# EAGLE design Breakout2v2 (EAGLE 9.0.1)
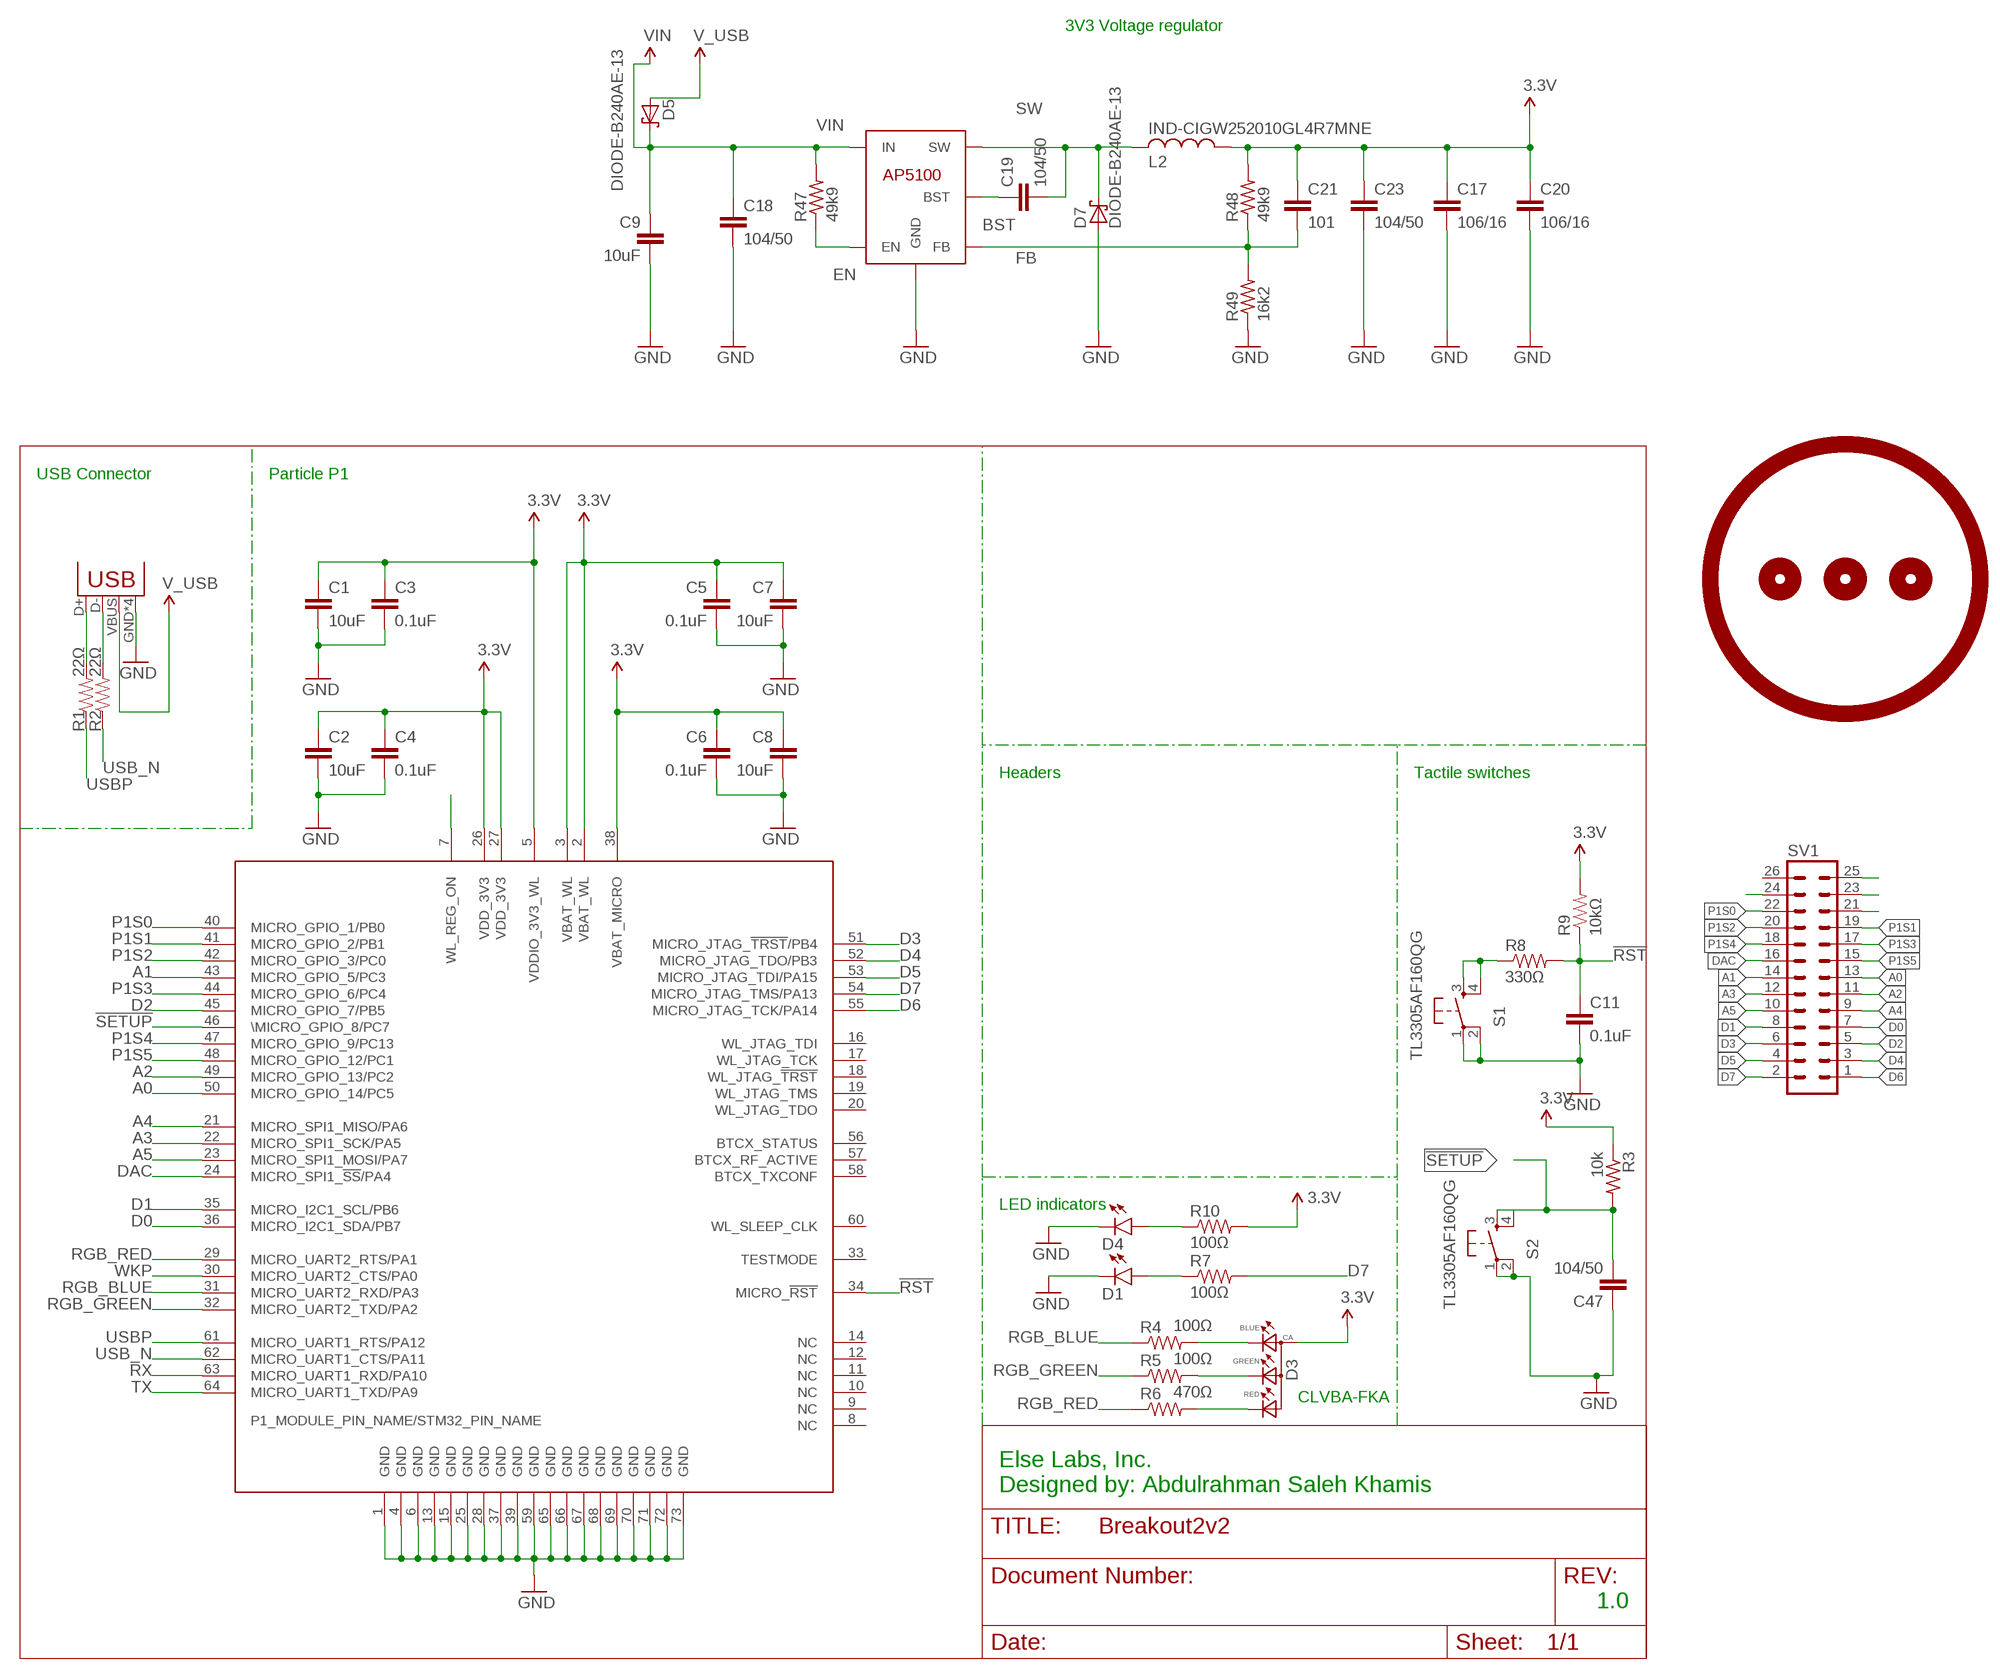
[diagram p0: schematic, sheet 1]

## Parts
C1  10uF  CAP0805  [0805]
C2  10uF  CAP0805  [0805]
C3  0.1uF  CAP0805  [0805]
C4  0.1uF  CAP0805  [0805]
C5  0.1uF  CAP0805  [0805]
C6  0.1uF  CAP0805  [0805]
C7  10uF  CAP0805  [0805]
C8  10uF  CAP0805  [0805]
C9  10uF  CAP0805  [0805]
C11  0.1uF  CAP0805  [0805]
C17  106/16  C-EUC0805  [C0805]
C18  104/50  C-EUC0603  [C0603]
C19  104/50  C-EUC0603  [C0603]
C20  106/16  C-EUC0805  [C0805]
C21  101  C-EUC0603  [C0603]
C23  104/50  C-EUC0603  [C0603]
C47  104/50  C-EUC0603  [C0603]
D1  LED0603  [LED-0603]
D3  CLVBA-FKAPLCC  [4-PLCC]
D4  LED0603  [LED-0603]
D5  DIODE-B240AE-13  [DO-214AC]
D7  DIODE-B240AE-13  [DO-214AC]
IC5  SMSP-BUCK-AP5100  [SOT23-6]
JP1  USBUSB-MICROB-SLOT-HOLE  [USB-MICROB-SLOT-HOLE]
L2  IND-CIGW252010GL4R7MNE  [L2520]
R1  22Ω  RESISTOR0805-RES  [0805]
R2  22Ω  RESISTOR0805-RES  [0805]
R3  10k  R-US_R0603  [R0603]
R4  100Ω  RESISTOR0805-RES  [0805]
R5  100Ω  RESISTOR0805-RES  [0805]
R6  470Ω  RESISTOR0805-RES  [0805]
R7  100Ω  RESISTOR0805-RES  [0805]
R8  330Ω  RESISTOR0805-RES  [0805]
R9  10kΩ  RESISTOR0805-RES  [0805]
R10  100Ω  RESISTOR0805-RES  [0805]
R47  49k9  R-US_R0603  [R0603]
R48  49k9  R-US_R0603  [R0603]
R49  16k2  R-US_R0603  [R0603]
S1  TL3305AF160QG  SWITCH-MOMENTARY-4.5MX4.5M  [TACTILE_SWITCH_SMD_4.5X4.5MM]
S2  TL3305AF160QG  SWITCH-MOMENTARY-4.5MX4.5M  [TACTILE_SWITCH_SMD_4.5X4.5MM]
SV1  MA13-2  [MA13-2]
U$1  LOGO  [LOGO]
UC1  P1  [WM-N-BM-14]

## Nets
3.3V: C1.1 C2.1 C3.1 C4.1 C5.1 C6.1 C7.1 C8.1 C17.1 C20.1 C21.1 C23.1 D3.2(ANODE) L2.P$1 R3.1 R9.2 R10.2 R48.2 UC1.2(VBAT_WL) UC1.3(VBAT_WL) UC1.5(VDDIO_3V3_WL) UC1.26(VDD_3V3) UC1.27(VDD_3V3) UC1.38(VBAT_MICRO)
!RST: C11.1 R8.2 R9.1 UC1.34(MICRO_!RST!)
!SETUP: C47.2 R3.2 S2.3 S2.4 UC1.46(\MICRO_GPIO_8/PC7)
A0: SV1.13 UC1.50(MICRO_GPIO_14/PC5)
A1: SV1.14 UC1.43(MICRO_GPIO_5/PC3)
A2: SV1.11 UC1.49(MICRO_GPIO_13/PC2)
A3: SV1.12 UC1.22(MICRO_SPI1_SCK/PA5)
A4: SV1.9 UC1.21(MICRO_SPI1_MISO/PA6)
A5: SV1.10 UC1.23(MICRO_SPI1_MOSI/PA7)
BLR: D3.3(BLUE) R4.2
BST: C19.1 IC5.1(BST)
D0: SV1.7 UC1.36(MICRO_I2C1_SDA/PB7)
D1: SV1.8 UC1.35(MICRO_I2C1_SCL/PB6)
D2: SV1.5 UC1.45(MICRO_GPIO_7/PB5)
D3: SV1.6 UC1.51(MICRO_JTAG_!TRST!/PB4)
D4: SV1.3 UC1.52(MICRO_JTAG_TDO/PB3)
D5: SV1.4 UC1.53(MICRO_JTAG_TDI/PA15)
D6: SV1.1 UC1.55(MICRO_JTAG_TCK/PA14)
D7: R7.2 SV1.2 UC1.54(MICRO_JTAG_TMS/PA13)
DAC: SV1.16 UC1.24(MICRO_SPI1_!SS!/PA4)
EN: IC5.4(EN) R47.1
FB: C21.2 IC5.3(FB) R48.1 R49.2
GND: C1.2 C2.2 C3.2 C4.2 C5.2 C6.2 C7.2 C8.2 C9.2 C11.2 C17.2 C18.2 C20.2 C23.2 C47.1 D1.C D4.C D7.A IC5.2(GND) JP1.GND JP1.P$1(GND) JP1.P$2(GND) JP1.P$3(GND) R49.1 S1.1 S1.2 S2.1 S2.2 UC1.1(GND) UC1.4(GND) UC1.6(GND) UC1.13(GND) UC1.15(GND) UC1.25(GND) UC1.28(GND) UC1.37(GND) UC1.39(GND) UC1.59(GND) UC1.65(GND) UC1.66(GND) UC1.67(GND) UC1.68(GND) UC1.69(GND) UC1.70(GND) UC1.71(GND) UC1.72(GND) UC1.73(GND)
GRR: D3.4(GREEN) R5.2
N$2: JP1.D+ R1.2
N$3: JP1.D- R2.2
N$6: D1.A R7.1
N$7: R8.1 S1.3 S1.4
N$9: D4.A R10.1
N$29: SV1.21
N$31: SV1.23
N$32: SV1.24
N$33: SV1.25
N$43: UC1.7(WL_REG_ON)
P1S0: SV1.22 UC1.40(MICRO_GPIO_1/PB0)
P1S1: SV1.19 UC1.41(MICRO_GPIO_2/PB1)
P1S2: SV1.20 UC1.42(MICRO_GPIO_3/PC0)
P1S3: SV1.17 UC1.44(MICRO_GPIO_6/PC4)
P1S4: SV1.18 UC1.47(MICRO_GPIO_9/PC13)
P1S5: SV1.15 UC1.48(MICRO_GPIO_12/PC1)
RER: D3.1(RED) R6.2
RGB_BLUE: R4.1 UC1.31(MICRO_UART2_RXD/PA3)
RGB_GREEN: R5.1 UC1.32(MICRO_UART2_TXD/PA2)
RGB_RED: R6.1 UC1.29(MICRO_UART2_RTS/PA1)
RX: UC1.63(MICRO_UART1_RXD/PA10)
SW: C19.2 D7.C IC5.6(SW) L2.P$2
TX: UC1.64(MICRO_UART1_TXD/PA9)
USB_N: R2.1 UC1.62(MICRO_UART1_CTS/PA11)
USBP: R1.1 UC1.61(MICRO_UART1_RTS/PA12)
V_USB: D5.A JP1.VBUS
VIN: C9.1 C18.1 D5.C IC5.5(IN) R47.2
WKP: UC1.30(MICRO_UART2_CTS/PA0)
Unconnected: SV1.26 UC1.8(NC) UC1.9(NC) UC1.10(NC) UC1.11(NC) UC1.12(NC) UC1.14(NC) UC1.16(WL_JTAG_TDI) UC1.17(WL_JTAG_TCK) UC1.18(WL_JTAG_!TRST!) UC1.19(WL_JTAG_TMS) UC1.20(WL_JTAG_TDO) UC1.33(TESTMODE) UC1.56(BTCX_STATUS) UC1.57(BTCX_RF_ACTIVE) UC1.58(BTCX_TXCONF) UC1.60(WL_SLEEP_CLK)

## Notes on the sheet
- 3V3 Voltage regulator
- USB Connector | Particle P1
- Headers | Tactile switches
- LED indicators
- CLVBA-FKA
- Else Labs, Inc.
  Designed by: Abdulrahman Saleh Khamis
- 1.0

## Library data of the parts
C1-C9 C11 = SparkFun-Capacitors:CAP: Capacitor Standard 0603 ceramic capacitor, and 0.1" leaded capacitor.
C17-C21 C23 C47 = rcl:C-EU: CAPACITOR, European symbol; SPICEPREFIX: C
D1 D4 = SparkFun-LED:LED: LEDs Standard schematic elements and footprints for 5mm, 3mm, 1206, and 0603 sized LEDs. 5mm - Spark Fun Electronics SKU : COM-00529 (and others)
D3 = ElseLabs:CLVBA-FKA: Everlight Red/Green/Blue LED 67-23/R6GHBHC-B01/2T || 67-23/R6GHBH-B01 Size 3.2*2.8*1.9mm Mounting Type SMD Full-Color LED PLCC4 Emitting Color Red/Green/Blue (620-625/530-535/470-475 nm) Chip Material AlGaInP/InGaN/InGaN Luminous Intensity 57-112/225-450/36-72 mcd Viewing Angle 120 deg Lens Type-Color Water Clear Forward Voltage 2.0/3.5/3.5 V Forward Current 10 mA Maximum Forward Voltage 2.4/3.9/3.9 V Maximum Forward Current 25/25/25 mA Min-Max Operating Temperature -40C to +85C Factory Pack 2000 pcs-Reel RoHS ✓; PROD_ID: DIO-12986
D5 D7 = TAHI EagleCAD part library:DIODE-B240AE-13
IC5 = TAHI EagleCAD part library:SMSP-BUCK-AP5100
JP1 = ElseLabs:USB
L2 = TAHI EagleCAD part library:IND-CIGW252010GL4R7MNE
R1 R2 R4-R10 = SparkFun-Resistors:RESISTOR: Resistor Basic schematic elements and footprints for 0603, 1206, and PTH resistors.
R3 R47-R49 = rcl:R-US_: RESISTOR, American symbol; SPICEPREFIX: R
S1 S2 = ElseLabs:SWITCH-MOMENTARY
SV1 = con-lstb:MA13-2: PIN HEADER; OC_FARNELL: unknown; OC_NEWARK: unknown
U$1 = ElseLabs:LOGO
UC1 = TAHI-brd-1v48:P1: Particle P1 module (WiFi with antenna)

## Net classes
0 as: width 0.203 mm, drill 0.35 mm, clearance 0.178 mm
1 USB: width 0.191 mm, drill 0.35 mm, clearance 0.356 mm

## Board
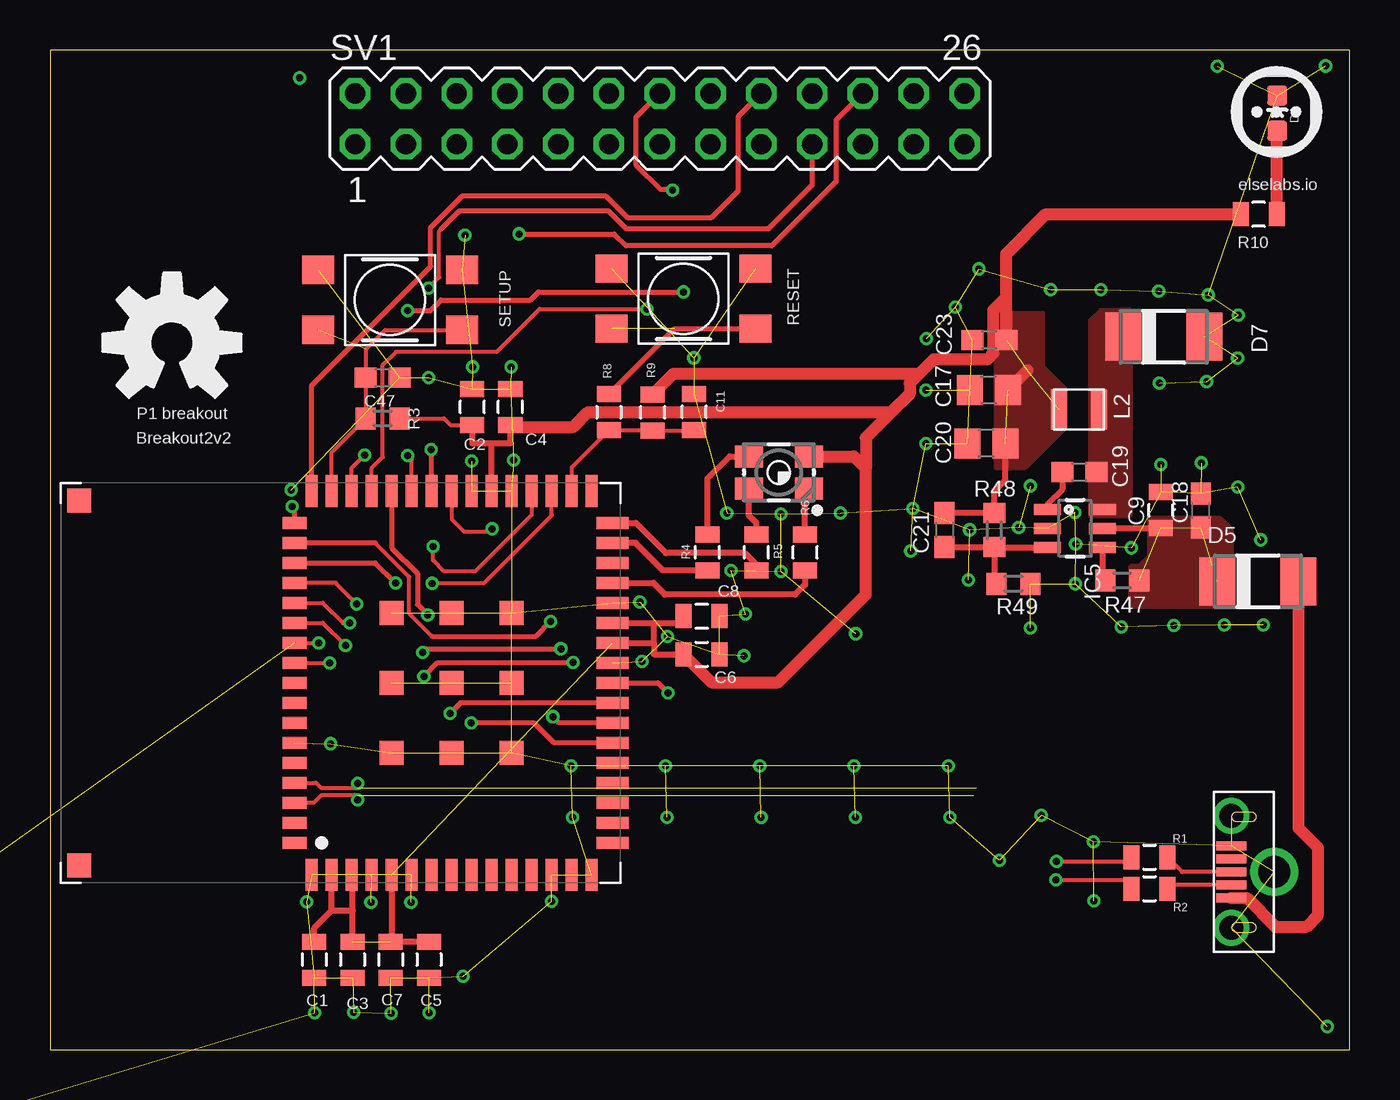
[diagram p1: board, top side]
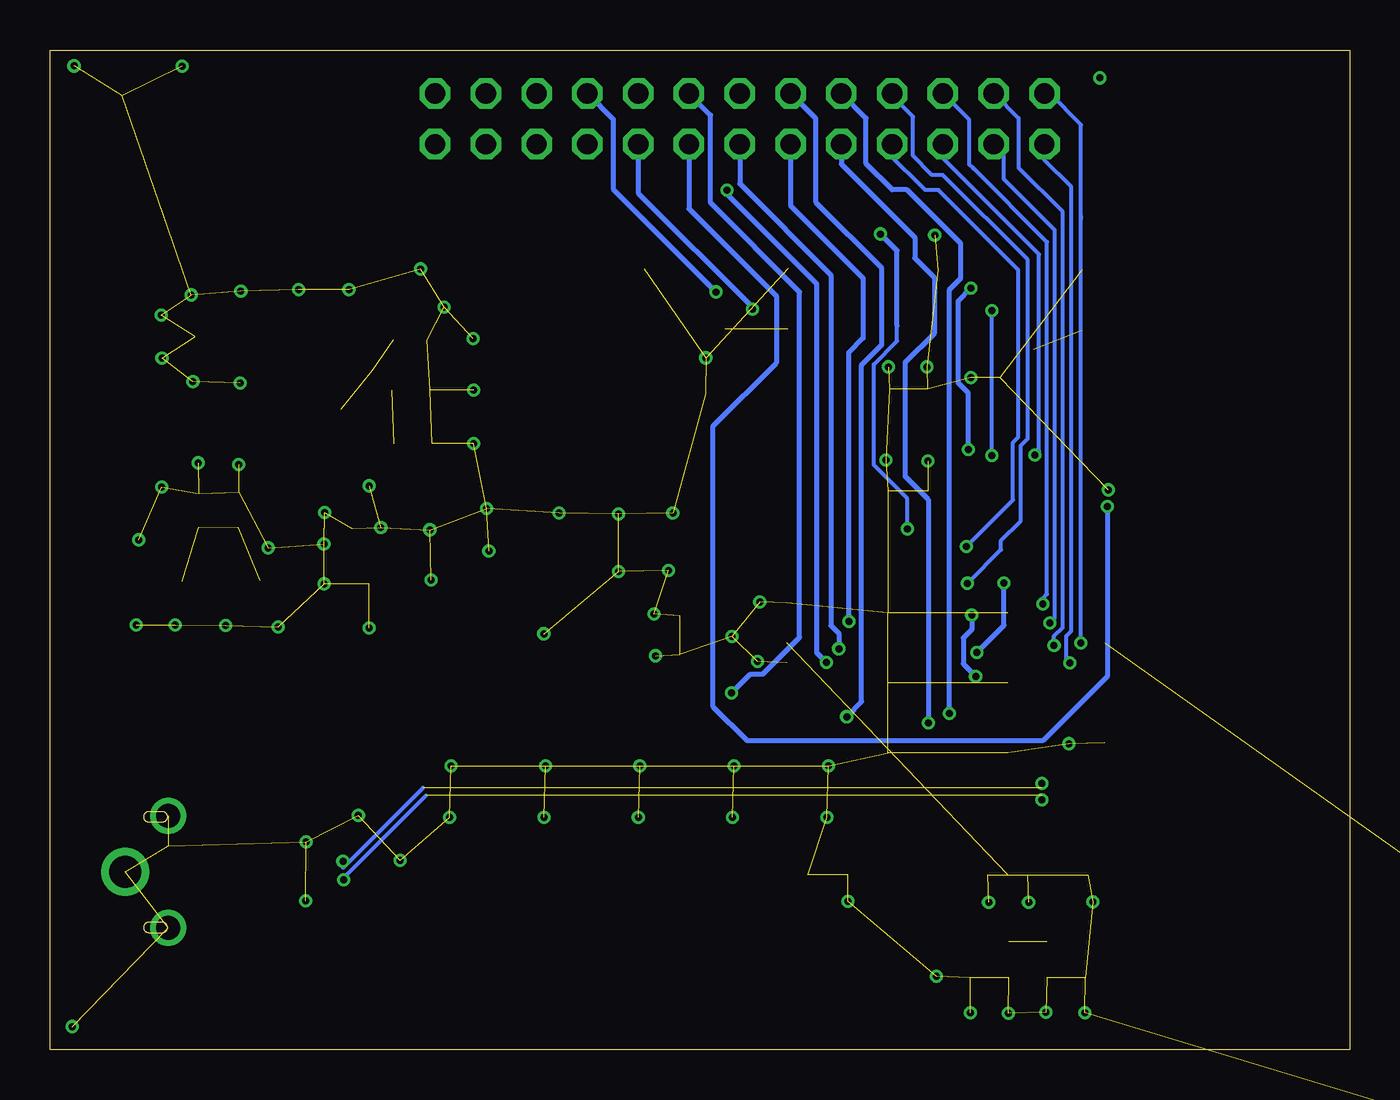
[diagram p2: board, bottom side, seen from below]

Size 65 x 50 mm. Coordinates in mm from the lower left corner, seen from the top.
Outline: 0,0 65,0 65,50 0,50 0,0
Copper layers (1*16): Top 0.035mm / dielectric 1.5mm / Bottom 0.035mm
Design rules "PCBway *": minimum track width 6mil, minimum drill 0.35mm, track to track 6mil, track to pad 6mil, pad to pad 6mil, via to via 6mil, smd to smd 0mil, copper to edge 7mil, drill to drill 6mil, minimum pad ring 6mil, minimum via ring 6mil, stop-mask expansion 2mil, vias tented up to drill 25mil, thermal gap 10mil

### Footprints (pad centres in the part's own frame; a part is rotated, then mirrored left to right if it is on the bottom)
0805 = smd 0.8 x 1.2: 1 -0.9,0; 2 0.9,0
C0805 = smd 1.3 x 1.5: 1 -0.95,0; 2 0.95,0
C0603 = smd 1.1 x 1: 1 -0.85,0; 2 0.85,0
LED-0603 = smd 1 x 1: A 0,-0.877; C 0,0.877
4-PLCC = smd 1.4 x 1.1: 1 -1.5,0.8; 2 -1.5,-0.8; 3 1.5,-0.8; 4 1.5,0.8
DO-214AC = smd 1.8 x 2.4: A 2.025,0; C -2.025,0
SOT23-6 = smd 0.55 x 1.35: 1 -0.95,-1.375; 2 0,-1.375; 3 0.95,-1.375; 4 0.95,1.375; 5 0,1.375; 6 -0.95,1.375
USB-MICROB-SLOT-HOLE = smd 0.45 x 1.5: D+ 0,0.635; D- -0.65,0.635; GND 1.3,0.635; ID 0.65,0.635; VBUS -1.3,0.635 | drill 1.2: P$1 2.8,0.635; P$2 -2.8,0.635 | drill 1.6: P$3 0,-1.515
L2520 = smd 0.8 x 2: P$1 -1,0; P$2 1,0
R0603 = smd 1 x 1.1: 1 -0.85,0; 2 0.85,0
TACTILE_SWITCH_SMD_4.5X4.5MM = smd 1.6 x 1.4: 1 -3.6,-1.5; 2 3.6,-1.5; 3 -3.6,1.5; 4 3.6,1.5
MA13-2 = drill 1.016 octagon: 1 -15.24,-1.27; 2 -15.24,1.27; 3 -12.7,-1.27; 4 -12.7,1.27; 5 -10.16,-1.27; 6 -10.16,1.27; 7 -7.62,-1.27; 8 -7.62,1.27; 9 -5.08,-1.27; 10 -5.08,1.27; 11 -2.54,-1.27; 12 -2.54,1.27; 13 0,-1.27; 14 0,1.27; 15 2.54,-1.27; 16 2.54,1.27; 17 5.08,-1.27; 18 5.08,1.27; 19 7.62,-1.27; 20 7.62,1.27; 21 10.16,-1.27; 22 10.16,1.27; 23 12.7,-1.27; 24 12.7,1.27; 25 15.24,-1.27; 26 15.24,1.27
WM-N-BM-14 = smd 1.6 x 0.6: 1 0.4,15.45; 2 0.4,14.45; 3 0.4,13.45; 4 0.4,12.45; 5 0.4,11.45; 6 0.4,10.45; 7 0.4,9.45; 8 0.4,8.45; 9 0.4,7.45; 10 0.4,6.45; 11 0.4,5.45; 12 0.4,4.45; 13 0.4,3.45; 14 0.4,2.45; 15 0.4,1.45; 33 19.6,1.45; 34 19.6,2.45; 35 19.6,3.45; 36 19.6,4.45; 37 19.6,5.45; 38 19.6,6.45; 39 19.6,7.45; 40 19.6,8.45; 41 19.6,9.45; 42 19.6,10.45; 43 19.6,11.45; 44 19.6,12.45; 45 19.6,13.45; 46 19.6,14.45; 47 19.6,15.45 | smd 0.6 x 1.6: 16 2,0.4; 17 3,0.4; 18 4,0.4; 19 5,0.4; 20 6,0.4; 21 7,0.4; 22 8,0.4; 23 9,0.4; 24 10,0.4; 25 11,0.4; 26 12,0.4; 27 13,0.4; 28 14,0.4; 29 15,0.4; 30 16,0.4; 31 17,0.4; 32 18,0.4 | smd 0.6 x 1.2: 48 18,16.3; 49 17,16.3; 50 16,16.3; 51 15,16.3; 52 14,16.3; 53 13,16.3; 54 12,16.3; 55 11,16.3; 56 10,16.3; 57 9,16.3; 58 8,16.3; 59 7,16.3; 60 6,16.3; 61 5,16.3; 62 4,16.3; 63 3,16.3; 64 2,16.3 | smd 1.2 x 1.2: 65 6.5,11.45; 66 6.5,8.45; 67 6.5,5.45; 68 10,11.45; 69 10,8.45; 70 10,5.45; 71 13.5,11.45; 72 13.5,8.45; 73 13.5,5.45; 74 19.12,27.07; 75 0.88,27.07

### Placement (x,y rotation side)
C1  13.21,4.5 270 top
C2  21.12,32.15 90 top
C3  15.13,4.5 270 top
C4  23.02,32.15 90 top
C5  18.95,4.5 270 top
C6  32.59,19.77 0 top
C7  17.04,4.5 270 top
C8  32.59,21.68 0 top
C9  55.57,26.98 90 top
C11  32.22,31.89 90 top
C17  46.95,32.98 180 top
C18  57.56,26.96 90 top
C19  51.48,28.89 0 top
C20  46.83,30.32 180 top
C21  44.74,25.99 270 top
C23  46.98,35.5 180 top
C47  16.64,33.6 180 top
D1  -45.26,-16.14 90 top  (outside the outline)
D3  36.45,28.87 180 top
D4  61.38,46.84 0 top
D5  60.42,23.42 0 top
D7  55.7,35.66 0 top
IC5  51.27,26.07 270 top
JP1  59.72,8.88 90 top
L2  51.47,32.01 0 top
R1  54.99,9.62 0 top
R2  54.99,8.05 0 top
R3  16.64,31.57 180 top
R4  32.88,24.87 90 top
R5  35.33,24.87 90 top
R6  37.77,24.87 90 top
R7  -44.37,-18.91 270 top  (outside the outline)
R8  27.95,31.88 270 top
R9  30.14,31.87 90 top
R10  60.46,41.78 180 top
R47  53.63,23.46 0 top
R48  47.23,25.98 90 top
R49  48.19,23.3 180 top
S1  31.68,37.56 180 top
S2  17,37.5 180 top
SV1  30.5,46.56 0 top
U$1  59.07,44.63 0 top
U$3  [OSHW-LOGO-L]  6.1,35.36 0 top
UC1  28.54,8.34 90 top

### Tracks (layer width: path | path; a pad name or v marks a point on that pad's centre or on a via)
3.3V  (5 unrouted)
  Top 0.203: 17.07,5.4 C7.1 | 15.14,8.74 UC1.3 | 30.14,32.09 29.94,31.88 | R3.1 19.7,31.57 20.03,31.24 C2.1 | 15.14,6.96 C3.1 | C1.1 13.21,6.16
  Top 0.305: C21.1 R48.2 47.23,27.94 47.78,28.49 C20.1 | C5.1 17.23,5.4 | 14.09,6.96 15.14,6.96 15.14,8.74 15.13,8.73 C3.1 | 14.09,6.96 UC1.2 14.07,8.72 14.07,7.01 | 31.69,21.61 C8.1 31.69,21.34 30.2,21.34 | UC1.38 22.09,30.33 | C2.1 21.12,30.33 22.09,30.33 | 22.09,30.33 23.02,30.33 C4.1 | UC1.27 30.2,21.34 | UC1.26 30.2,20.34 | 30.2,20.34 30.2,21.34 | 30.2,20.34 30.2,19.77 C6.1 | UC1.5 17.09,5.54 17.23,5.4 | C7.1 17.23,5.4 | C1.1 13.21,6.08 14.09,6.96
  Top 0.61: C23.1 47.83,37.63 | 47.83,37.63 47.83,39.8 49.81,41.78 R10.2 | 18.99,5.43 C5.1 | 48.89,33.97 C17.1 | D3.2 40.2,29.67 40.81,29.06 | C4.1 23.14,31.14 26.18,31.14 26.92,31.88 29.94,31.88 42.08,31.88 | 40.81,29.06 40.81,22.76 36.42,18.37 33.09,18.37 C6.1 | 42.08,31.88 43,32.8 43,33.33 43.46,33.79 | 47.83,37.63 47.16,36.96 47.16,34.8 46.88,34.52 44.19,34.52 43.46,33.79 | 42.08,31.88 40.81,30.61 40.81,29.06 | R9.2 31.16,33.79 43.46,33.79
  pour Top (no thermals): 50.79,33.02 49.67,34.14 49.67,36.82 47.31,36.82 47.31,29.12 48.76,29.12 50.79,31.15
!RST
  Top 0.203: UC1.34 26.09,29.11 R8.2 27.96,30.97 R9.1 32.2,30.97 C11.1
!SETUP  (1 unrouted)
  Top 0.203: UC1.46 14.09,29.87 R3.2 C47.2 15.81,33.62 15.81,35.04 16.77,36 S2.3
A0  (via drill 0.35)
  Top 0.254: UC1.50 16.27,24.34 v17.28,23.33 | v18.64,19.86 18.83,20.05 v25.55,20.05
  Bottom 0.254: v18.64,19.86 17.28,21.22 v17.28,23.33 | v25.55,20.05 25.55,20.82 25.94,21.21 25.94,38.75 30.5,43.31 SV1.13
A1  (via drill 0.35)
  Top 0.254: v18.9,21.74 18.38,22.26 18.38,23.81 17.09,25.09 UC1.43 | v18.7,18.67 19.39,19.36 v26.17,19.36 | v31.14,42.99 31.1,43.03 30.53,43.03 29.29,44.27 29.29,46.62 SV1.14
  Bottom 0.254: v18.9,21.74 18.9,21.01 19.32,20.59 19.32,19.29 v18.7,18.67 | v26.17,19.36 26.65,19.84 26.65,38.29 31.14,42.78 v31.14,42.99
A2  (via drill 0.35)
  Top 0.203: 16.27,25.34 17.97,23.64 17.97,21.81 19.11,20.68
  Top 0.254: 16.27,25.34 UC1.49 | 19.11,20.68 24.31,20.68 v25.04,21.41
  Bottom 0.254: v25.04,21.41 25.04,34.87 24.33,35.58 24.33,38.58 27.96,42.21 SV1.11
A3  (via drill 0.35)
  Top 0.254: UC1.22 25.46,16.34 v25.15,16.65
  Bottom 0.254: 24.75,17.05 v25.15,16.65 24.41,17.39 24.41,34.24 23.39,35.26 23.39,39.08 26.7,42.4 26.7,46.58 SV1.12
A4  (via drill 0.35)
  Top 0.254: UC1.21 25.2,15.34 24.21,16.33 v21.07,16.33
  Bottom 0.254: v21.07,16.33 21.07,27.51 22.22,28.66 22.22,34.38 20.75,35.85 20.75,38.6 21.75,39.6 21.75,40.62 25.42,44.29 SV1.9
A5  (via drill 0.35)
  Top 0.254: UC1.23 20.53,17.34 v20.01,16.82
  Bottom 0.254: v20.01,16.82 20.01,38.02 19.45,38.58 19.45,40.32 22.14,43.01 22.87,43.01 24.18,44.32 24.18,46.59 SV1.10
BLR
  Top 0.203: D3.3 34.84,29.78
  Top 0.305: R4.2 32.88,28.55 34,29.67 D3.3
BST
  Top 0.305: C19.1 50.63,28.01 49.9,27.28 IC5.1
D0  (via drill 0.35)
  Top 0.203: UC1.36 24.09,26.74 21.27,23.92 19.72,23.92 19.16,24.48 v19.16,25.16
  Bottom 0.2: SV1.7 22.88,44.65 21.47,43.24
  Bottom 0.203: 21.47,43.24 21.22,42.99 20.56,42.99 16.57,39 16.57,30.63 16.83,30.37 16.83,27.49 v19.16,25.16
D1  (via drill 0.35)
  Top 0.203: UC1.35 25.09,26.72 21.69,23.32 v19.11,23.32
  Bottom 0.203: SV1.8 23,47.83 21.83,46.66 21.83,44.7 20.88,43.75 20.34,43.75 16.1,39.51 16.1,30.56 16.45,30.21 16.45,26.45 17.43,25.47 17.43,25 v19.11,23.32
D2  (via drill 0.35)
  Top 0.203: UC1.45 15.09,29.1 v15.74,29.75
  Bottom 0.2: SV1.5 20.34,44.59 19.21,43.47
  Bottom 0.203: v15.74,29.75 15.53,29.95 15.53,39.78 19.21,43.47
D3  (via drill 0.35)
  Top 0.203: v15.35,22.29 14.3,23.34 UC1.51
  Bottom 0.2: SV1.6 19.02,46.51 19.02,44.27 18.82,44.08
  Bottom 0.203: v15.35,22.29 15.35,22.56 15.13,22.78 15.13,40.39 18.82,44.08
D4  (via drill 0.35)
  Top 0.203: UC1.52 13.64,22.34 14.65,21.33 v14.99,21.33
  Bottom 0.2: SV1.3 17.31,44.8 17.31,43.57
  Bottom 0.203: v14.99,21.33 14.74,21.58 14.74,41 17.31,43.57
D5  (via drill 0.35)
  Top 0.203: UC1.53 13.65,21.34 v14.78,20.21
  Bottom 0.2: SV1.4 16.56,46.59 16.56,45.55
  Bottom 0.203: v14.78,20.21 14.78,20.68 14.35,21.11 14.35,41.91 16.56,44.12 16.56,45.55
D6  (via drill 0.35)
  Top 0.203: UC1.55 v13.99,19.34
  Bottom 0.2: 13.92,43.16 15.26,44.5 SV1.1
  Bottom 0.203: v13.99,19.34 14.17,19.52 14.17,20.68 13.92,20.93 13.92,43.16
D7  (via drill 0.35)  (1 unrouted)
  Top 0.2: UC1.54 v13.43,20.34
  Bottom 0.2: 13.43,41.57 13.43,41.68
  Bottom 0.203: v13.43,20.34 13.43,41.57 13.43,46.26 15,47.83 SV1.2
DAC  (via drill 0.35)
  Top 0.254: UC1.24 30.4,18.34 v30.91,17.83
  Bottom 0.254: v30.91,17.83 29.96,18.78 29.35,18.78 27.51,20.62 27.51,37.9 31.96,42.35 31.96,46.75 SV1.16
EN
  Top 0.305: IC5.4 52.65,23.59 R47.1
FB
  Top 0.305: C21.2 R48.1 | R48.1 IC5.3 | R48.1 47.23,23.41 R49.2
GND  (via drill 0.35)  (124 unrouted)
  other vias: 51.26,26.87 51.3,25.29 48.45,26.11 45.93,23.48 43.84,35.56 43.81,32.99 43.82,30.31 49.03,28.2 51.29,23.3 57.94,37.75 59.43,36.73 59.4,34.59 57.85,33.41 55.49,33.33 57.58,29.35 55.56,29.26 60.69,21.23 58.73,21.23 56.21,21.21 53.58,21.13 49.03,21.08 54.09,25.1 55.45,37.94 59.42,28.14 60.57,25.5 46,26 46.47,39.05 52.2,10.39 49.58,11.71 47.49,9.46 52.57,38.02 50.05,38.02 45.29,37.14 13.23,1.83 15.18,1.87 17.06,1.81 18.97,1.83 20.67,3.66 12.07,28 12.83,7.38 16.05,7.36 18.05,7.36 14.03,15.3 29.5,22.38 29.61,19.41 30.88,20.67 23.19,29.49 21.09,29.44 25.09,7.41 21.13,34.15 23.06,34.15 33.85,26.83 36.56,26.79 36.56,23.91 34.79,21.78 34.71,19.7 34.07,23.96 39.54,26.83 40.3,20.8 58.38,49.19 43.05,24.94 43.17,27.07 18.94,33.61 32.2,34.6 26.06,14.2 26.13,11.62 30.78,14.2 30.85,11.62 35.5,14.2 35.57,11.62 40.22,14.2 40.3,11.62 44.94,14.2 45.02,11.62 52.21,7.43 63.88,1.15 63.8,49.2 20.75,40.73
GRR
  Top 0.203: 34.9,28.02 D3.4
  Top 0.305: R5.2 35.33,26.34 34.95,26.72 D3.4
N$2
  Top 0.191: JP1.D+ 56.63,8.88 R1.2
  Top 0.203: 56.16,9.62 R1.2
N$3
  Top 0.191: JP1.D- 56.07,8.23 R2.2
  Top 0.203: R2.2 56.13,8.05
N$6  (1 unrouted)
N$7  (1 unrouted)
  Top 0.203: 27.95,35.94 S1.4
  Top 0.254: R8.1 31.23,36.06 S1.3
N$9
  Top 0.61: R10.1 61.36,45.94 D4.A
N$10  (via drill 0.35)
  other vias: 12.48,48.6
P1S0  (via drill 0.35)
  Top 0.203: UC1.40 20.09,26.53 20.7,25.91 21.98,25.91 v22.12,26.05
  Top 0.254: v23.46,40.8 28.22,40.8 28.82,40.2 36.11,40.2 39.32,43.41 39.32,46.49 SV1.22
  Bottom 0.203: 22.63,39.22 22.63,36.2 22.63,35.44 23.8,34.27 23.8,29.24 22.12,27.56 v22.12,26.05
  Bottom 0.254: 22.63,36.2 22.63,39.97 v23.46,40.8
P1S1  (via drill 0.35)
  Top 0.203: v18.93,38.09 19.47,38.63 19.47,40.94 19.56,41.03
  Top 0.254: UC1.41 19.09,30 v19.07,30.02 | 19.56,41.03 20.48,41.95 27.92,41.95 28.84,41.04 35.92,41.04 38.12,43.24 SV1.19
  Bottom 0.254: v19.07,30.02 19.07,32.85 19.57,33.35 19.57,37.45 v18.93,38.09
P1S2  (via drill 0.35)
  Top 0.203: UC1.42 18.09,29.51 v17.88,29.72
  Top 0.254: v17.88,36.96 19.02,36.96 19.56,37.5 24.03,37.5 24.43,37.9 v31.69,37.9
  Bottom 0.203: v17.88,29.72 v17.88,36.96
  Bottom 0.254: v31.69,37.9 36.83,43.04 36.83,46.54 SV1.20
P1S3  (via drill 0.35)
  Top 0.203: UC1.44 16.09,29.08 16.64,29.63 16.64,34.23 17.3,34.89 22.34,34.89 24.49,37.04 v29.87,37.04
  Bottom 0.203: 29.87,37.13 v29.87,37.04
  Bottom 0.254: SV1.17 35.58,42.84 29.87,37.13
P1S4
  Top 0.254: UC1.47 13.09,33.22 19.04,39.17 19.04,41.12 20.63,42.71 27.78,42.71 28.88,41.62 33.09,41.62 34.43,42.96 34.43,46.68 SV1.18
P1S5  (via drill 0.35)
  Top 0.254: UC1.48 12.24,27.04 v12.12,27.16
  Bottom 0.254: v12.12,27.16 12.12,18.66 15.34,15.44 30.12,15.44 31.83,17.15 31.83,31.19 28.67,34.35 28.67,37.69 33.04,42.06 SV1.15
RER
  Top 0.203: 37.77,27.89 D3.1
  Top 0.305: R6.2 37.77,27.89
RGB_BLUE
  Top 0.305: UC1.31 29.29,25.34 30.66,23.97 R4.1
RGB_GREEN
  Top 0.203: R5.1 35.33,24.26
  Top 0.305: UC1.32 29.3,26.34 30.81,24.83 34.76,24.83 35.33,24.26
RGB_RED
  Top 0.305: UC1.29 30.18,23.34 30.76,22.76 37.27,22.76 37.77,23.26 R6.1
SW
  pour Top (no thermals): 54,26.69 52.06,26.69 52.06,36.48 52.58,37 54,37
USB_N  (via drill 0.35)  (1 unrouted)
  Top 0.203: v15.39,12.48 15.39,12.71 13.56,12.71 13.19,12.34 UC1.62 | R2.1 54.09,8.48 v50.31,8.48
  Bottom 0.203: 46.19,12.71 50.31,8.59 v50.31,8.48 | 15.39,12.71 v15.39,12.48
USBP  (via drill 0.35)  (1 unrouted)
  Top 0.203: v15.39,13.32 15.39,13.09 13.56,13.09 13.31,13.34 UC1.61 | v50.35,9.41 53.88,9.41 R1.1
  Bottom 0.203: v50.35,9.41 50.35,9.09 46.35,13.09 | 15.39,13.09 v15.39,13.32
V_USB
  Top 0.61: D5.A 62.45,11.09 63.41,10.12 63.41,6.71 62.85,6.15 61.28,6.15 59.85,7.58 JP1.VBUS
VIN  (3 unrouted)
  Top 0.305: C9.1 IC5.5
  pour Top (no thermals): 59.05,22.22 59.05,25.99 58.5,26.54 55.05,26.54 55.02,26.51 55.02,24.75 55.05,24.72 54.46,24.13 54.07,24.13 54.07,22.22

### Text on the board
tPlace: SETUP | RESET
tNames: elselabs.io | P1 breakout | Breakout2v2 | A0 | A1 | A2 | A3 | A4 | A5 | RX | TX | VIN | DAC | WKP | GND | BLUE | RED | GREEN | 3V3 | RST | GND | D7 | D6 | D5 | D4 | D3 | D2 | D1 | D0 | S5 | S4 | S3 | S2 | S1 | S0